# Altium schematic sheet MCISO-S04-V00-Microcontroller.SchDoc: MCISO Microcontroller
size A3; DrawnBy: John Hatfield & Bishwam Pattnaik; DocumentNumber: 4; Revision: 01; SheetNumber: 3; SheetTotal: 8; Version: 01; Project: MCISO QEV3; PageSetup: Record=PageOptions|CenterHorizontal=True|CenterVertical=True|PrintScale=0.97|XCorrection=1.00|YCorrection=1.00|PrintKind=0|BorderSize=5000000|LeftOffset=0|BottomOffset=0|Orientation=2|PaperLength=1000|PaperWidth=1000|Scale=100|PaperSource=7|PrintQuality=-4|MediaType=1|DitherType=10|PaperKind=A4|PrintScaleMode=1
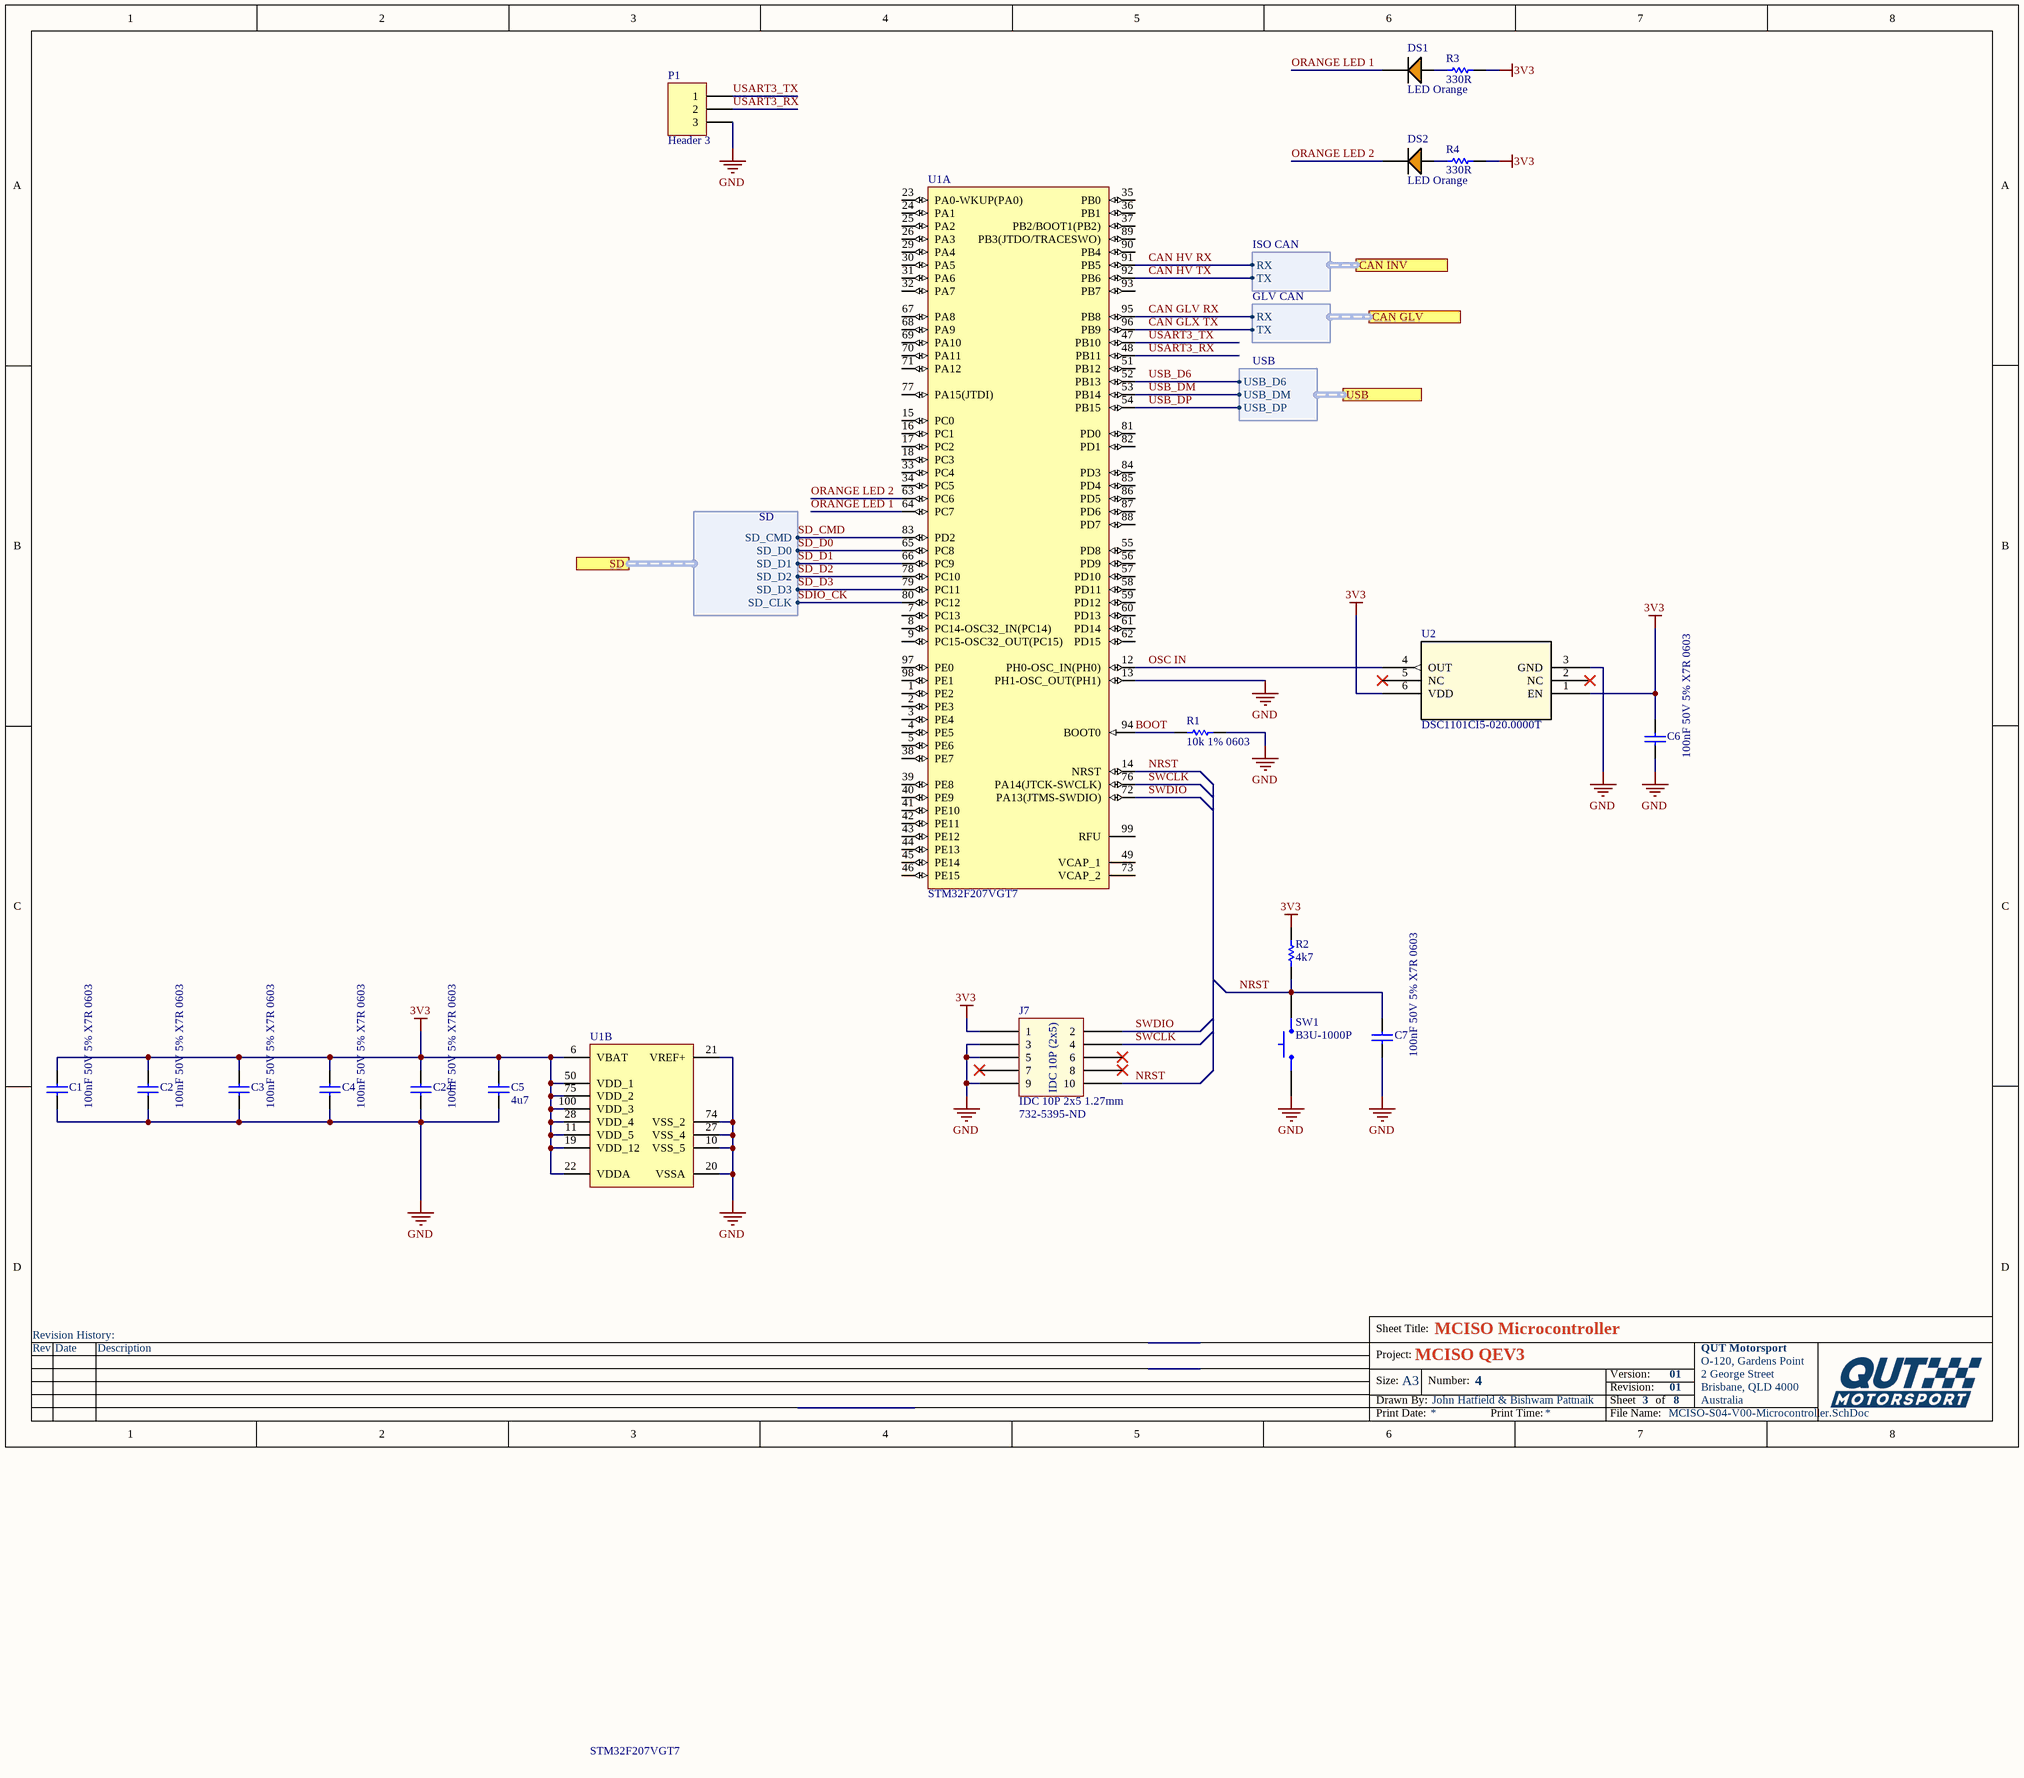
[diagram p0: MCISO-S04-V00-Microcontroller.SchDoc]

## Parts
C1  100nF 50V 5% X7R 0603  [Cap_Ceramic_0603]
C2  100nF 50V 5% X7R 0603  [Cap_Ceramic_0603]
C3  100nF 50V 5% X7R 0603  [Cap_Ceramic_0603]
C4  100nF 50V 5% X7R 0603  [Cap_Ceramic_0603]
C5  4u7  [Cap_Ceramic_0603]
C6  100nF 50V 5% X7R 0603  [Cap_Ceramic_0603]
C7  100nF 50V 5% X7R 0603  [Cap_Ceramic_0603]
C24  100nF 50V 5% X7R 0603  [Cap_Ceramic_0603]
DS1  LED Orange  [LED ORANGE 0603]
DS2  LED Orange  [LED ORANGE 0603]
J7  IDC 10P 2x5 1.27mm  [IDC 1.27MM 10P]
P1  Header 3  [HDR1X3]
R1  10k 1% 0603  [Res_ThinFilm_0603]
R2  4k7  [Res_ThinFilm_0603]
R3  330R  [Res_ThinFilm_0603]
R4  330R  [Res_ThinFilm_0603]
SW1  B3U-1000P  [BTN B3U-1000P]
U1  STM32F207VGT7  [STM-LQFP100_N]  (parts A,B of 2)
U2  DSC1101CI5-020.0000T  [VDFN6_3P2X2P5_MCH]

## Ports
CAN GLV (harness GLV CAN), CAN INV (harness ISO CAN), SD (harness SD), USB (harness USB)

## Harnesses
ISO CAN: TX, RX
GLV CAN: RX, TX
USB: USB_DM, USB_DP, USB_D6
SD: SD_D0, SD_D1, SD_D2, SD_D3, SD_CLK, SD_CMD

## Nets
3V3: C1.2 C2.2 C3.2 C4.2 C5.2 C6.2 C24.2 J7.1 R2.2 R3.2 R4.2 U1.6(VBAT) U1.11(VDD_5) U1.19(VDD_12) U1.22(VDDA) U1.28(VDD_4) U1.50(VDD_1) U1.75(VDD_2) U1.100(VDD_3) U2.1(EN) U2.6(VDD)
GND: C1.1 C2.1 C3.1 C4.1 C5.1 C6.1 C7.1 C24.1 J7.3 J7.5 J7.9 P1.3 R1.2 SW1.1 U1.10(VSS_5) U1.13(PH1-OSC_OUT(PH1)) U1.20(VSSA) U1.21(VREF+) U1.27(VSS_4) U1.74(VSS_2) U2.3(GND)
BOOT: R1.1 U1.94(BOOT0)
CAN GLV RX: U1.95(PB8) ; port CAN GLV.RX
CAN GLX TX: U1.96(PB9) ; port CAN GLV.TX
CAN HV RX: U1.91(PB5) ; port CAN INV.RX
CAN HV TX: U1.92(PB6) ; port CAN INV.TX
NRST: C7.2 J7.10 R2.1 SW1.2 U1.14(NRST)
ORANGE LED 1: DS1.2(C) U1.64(PC7)
ORANGE LED 2: DS2.2(C) U1.63(PC6)
OSC IN: U1.12(PH0-OSC_IN(PH0)) U2.4(OUT)
SD_CMD: U1.83(PD2) ; port SD.SD_CMD
SD_D0: U1.65(PC8) ; port SD.SD_D0
SD_D1: U1.66(PC9) ; port SD.SD_D1
SD_D2: U1.78(PC10) ; port SD.SD_D2
SD_D3: U1.79(PC11) ; port SD.SD_D3
SDIO_CK: U1.80(PC12) ; port SD.SD_CLK
SWCLK: J7.4 U1.76(PA14(JTCK-SWCLK))
SWDIO: J7.2 U1.72(PA13(JTMS-SWDIO))
USART3_RX: P1.2 U1.48(PB11)
USART3_TX: P1.1 U1.47(PB10)
USB_D6: U1.52(PB13) ; port USB.USB_D6
USB_DM: U1.53(PB14) ; port USB.USB_DM
USB_DP: U1.54(PB15) ; port USB.USB_DP
NetDS1_1: DS1.1(A) R3.1
NetDS2_1: DS2.1(A) R4.1

Not connected (* = marked no-connect by the designer): J7 6* 7* 8*; U1 1(PE2) 2(PE3) 3(PE4) 4(PE5) 5(PE6) 7(PC13) 8(PC14-OSC32_IN(PC14)) 9(PC15-OSC32_OUT(PC15)) 15(PC0) 16(PC1) 17(PC2) 18(PC3) 23(PA0-WKUP(PA0)) 24(PA1) 25(PA2) 26(PA3) 29(PA4) 30(PA5) 31(PA6) 32(PA7) 33(PC4) 34(PC5) 35(PB0) 36(PB1) 37(PB2/BOOT1(PB2)) 38(PE7) 39(PE8) 40(PE9) 41(PE10) 42(PE11) 43(PE12) 44(PE13) 45(PE14) 46(PE15) 49(VCAP_1) 51(PB12) 55(PD8) 56(PD9) 57(PD10) 58(PD11) 59(PD12) 60(PD13) 61(PD14) 62(PD15) 67(PA8) 68(PA9) 69(PA10) 70(PA11) 71(PA12) 73(VCAP_2) 77(PA15(JTDI)) 81(PD0) 82(PD1) 84(PD3) 85(PD4) 86(PD5) 87(PD6) 88(PD7) 89(PB3(JTDO/TRACESWO)) 90(PB4) 93(PB7) 97(PE0) 98(PE1) 99(RFU); U2 2(NC)* 5(NC)*

## Notes on the sheet
- (near J7) 732-5395-ND
- Revision History:
- Sheet Title:
- Rev
- Date
- Description
- Project:
- Size:
- Drawn By:
- A3
- Number:
- Revision:
- Sheet
- Version:
- of
- QUT Motorsport
- O-120, Gardens Point
- 2 George Street
- Brisbane, QLD 4000
- Australia
- Print Date:
- Print Time:
- File Name:
- (in symbol IDC 10P 2x5 1.27mm) IDC 10P (2x5)

## Library data of the parts
C1-C4 C6 C7 C24 = 100nF 50V 5% X7R 0603: Capacitor, Ceramic, SMD, 100nF, 50V, 5%, X7R, 0603
C5 = 4u7 50V 5% X7R 0603: Capacitor, Ceramic, SMD, 4u7, 50V, 5%, X7R, 0603
DS1 DS2 = LED ORANGE 0603
P1 = Header 3: Header, 3-Pin; LatestRevisionDate: 17-Jul-2002; LatestRevisionNote: Re-released for DXP Platform.; Publisher: Altium Limited
R1 = 20k 1% 0603: Resistor, SMD, 20k, 0.1W, 5%, 0603
R2 = 4k7 5% 0603: Resistor, SMD, 4k7, 0.1W, 5%, 0603
R3 R4 = 330R 5% 0603: Resistor, SMD, 330R, 0.1W, 5%, 0603
SW1 = BTN B3U-1000P: Omron B3U-1000P Ultra Miniture Switch; ComponentLink1Description: LCSC; ComponentLink1URL: https://lcsc.com/product-detail/Tactile-Switches_BRIGHT-TSA063G50-250_C294565.html
U1 = STM32F207VGT7-Custom: ARM Cortex-M3 32-bit MCU, 1024 KB Flash, 128 KB Internal RAM, 82 I/Os, 100-pin LQFP, -40 to 105 degC, Tray; D/A Converter: 2x12-bit (2 Channel); Internal RAM Size (kB): 128; Supply Voltage(Vcc) min (V): 1.8; I/Os (High Current): 82; Operating Frequency(F) (Processor speed) (MHz): 120; FLASH Size (Prog) (kB): 1024; PartNumber: STM32F207VGT7; DatasheetVersion: Rev. 9; Core: ARM Cortex-M3; ComponentLink3Description: Package Specification; ComponentLink3URL: http://www.st.com/st-web-ui/static/active/en/resource/technical/document/data_brief/DM00071938.pdf; PackageDescription: 100-Pin Low Profile Quad Flat Package, 14 x 14 mm Body, 0.5 mm Pitch; ComponentLink1Description: Manufacturer URL; PackageVersion: Rev. 1, 06/2013; ComponentLink1URL: http://www.st.com/web/en/home.html; PackageReference: LQFP100; ComponentLink2Description: Datasheet; ComponentLink2URL: http://www.st.com/st-web-ui/static/active/en/resource/technical/document/datasheet/CD00237391.pdf; Mounting Technology: Surface Mount; Packing: Tray
U2 = DSC1101CI5-020.0000T: No Description Available; Vendor: Microchip; Built_By: EMA_Jessica; SourceLibrary: Microchip_2019-08-23_23; Manufacturer_Part_Number: DSC1101CI5-020.0000T; Copyright: Copyright (C) 2018 Accelerated Designs. All rights reserved; RefDes: RefDes; Type: DEV